# Altium schematic sheet Machine_Side_v1.0.SchDoc
size A4
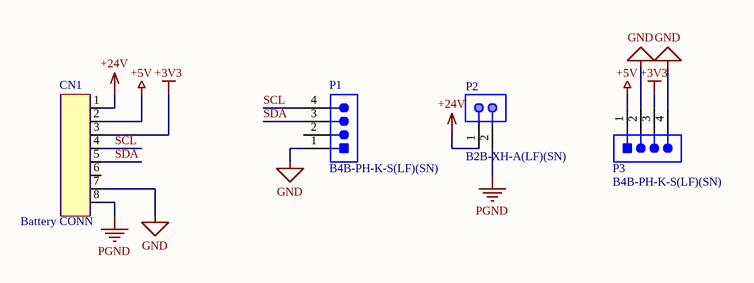
[diagram p0: Machine_Side_v1.0.SchDoc]

## Parts
CN1  Battery CONN  [1747786-1]
P1  B4B-PH-K-S(LF)(SN)  [JST-B4B-PH-K-S_V]
P2  B2B-XH-A(LF)(SN)  [JST-B2B-XH-A_V]
P3  B4B-PH-K-S(LF)(SN)  [JST-B4B-PH-K-S_V]

## Nets
+3V3: CN1.3 P3.3
+5V: CN1.2 P3.1
+24V: CN1.1 P2.1
GND: CN1.7 P1.1 P3.2 P3.4
PGND: CN1.8 P2.2
SCL: CN1.4 P1.4
SDA: CN1.5 P1.3

Not connected (* = marked no-connect by the designer): CN1 6; P1 2

## Library data of the parts
CN1 = 1747786-1
P1 P3 = CMP-2000-05165-1: Male Header, Pitch 2 mm, 1 x 4 Position, Height 6 mm, Tail Length 3.4 mm, -25 to 85 degC, RoHS, Bulk; Manufacturer: JST; No of Positions: 4; Style/Orientation: StraightHeader/Plug; Pitch: 2mm; Datasheet URL: http://datasheet.octopart.com/B4B-PH-K-S%28LF%29%28SN%29-JST-datasheet-10558886.pdf; Type: ShroudedHeader; Manufacturer URL: http://www.jst.com/home2.html; Termination: Crimp; Datasheet Version: Apr-09
P2 = CMP-2000-05888-1: Male Header, Pitch 2.5 mm, 1 x 2 Position, Height 7 mm, Tail Length 3.4 mm, -25 to 85 degC, RoHS, Bulk; Manufacturer: JST; No of Positions: 2; Pitch: 2.5mm; Style/Orientation: StraightHeader/Plug; Datasheet Version: 05/2016; Package Description: Male Header, Pitch 2.5 mm, 1 x 2 Position, Height 7 mm, Tail Length 3.4 mm; Package Reference: B2B-XH-A; Mounting Technology: ThroughHole; Type: ShroudedHeader; Datasheet URL: http://www.jst-mfg.com/product/pdf/eng/eXH.pdf; Manufacturer URL: http://www.jst.com/home2.html; Termination: Crimp